# Altium schematic sheet USBC.SchDoc
size A; SheetNumber: 8; SheetTotal: 14
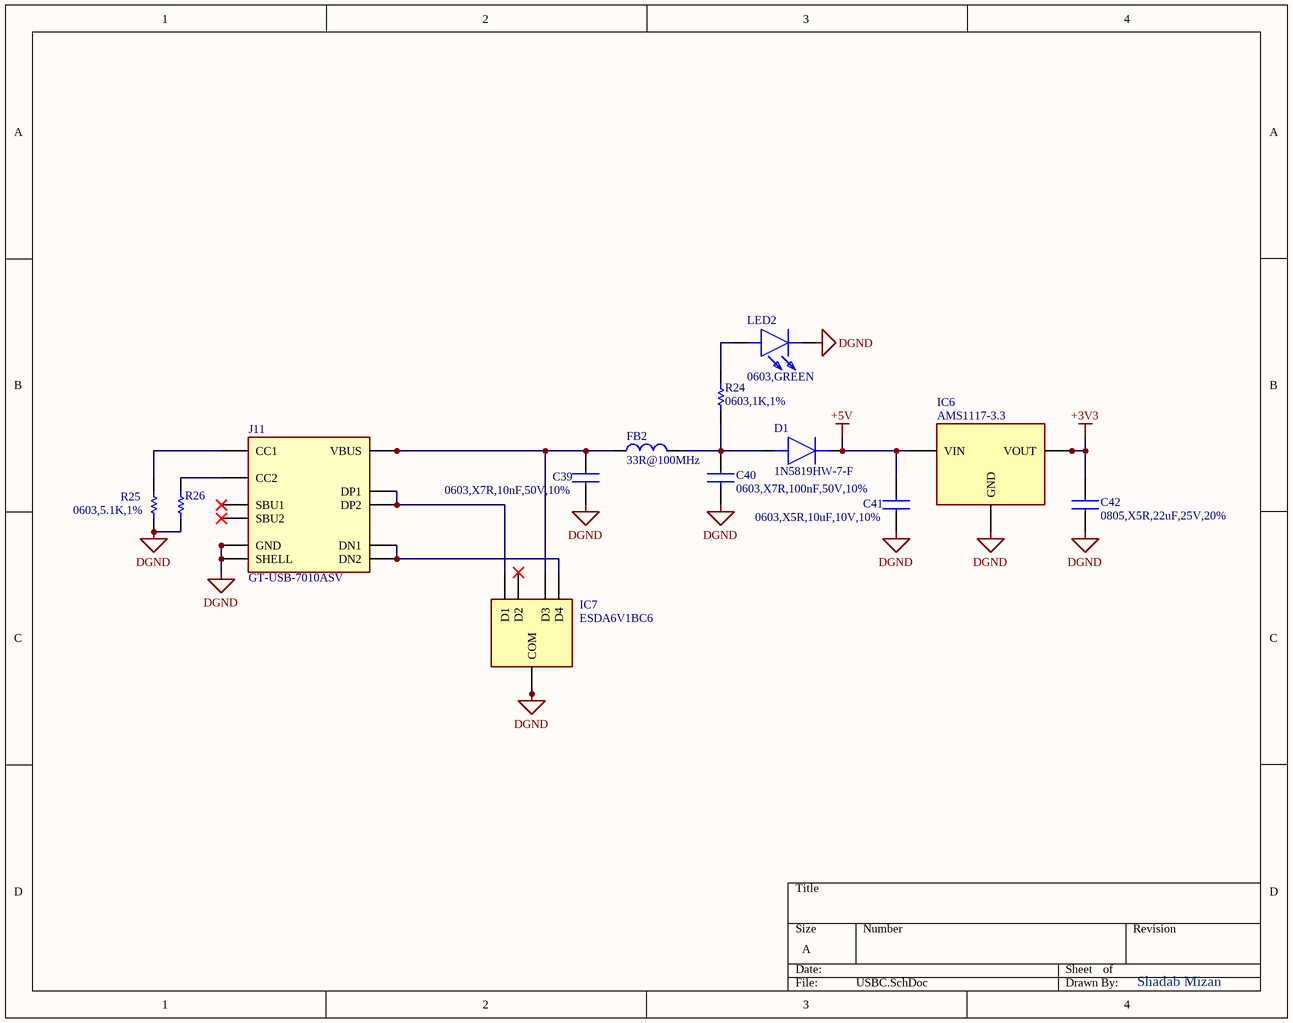
[diagram p0: USBC.SchDoc]

## Parts
C39  0603,X7R,10nF,50V,10%  [CAPC1608X90N]
C40  0603,X7R,100nF,50V,10%  [CAPC1608X90N]
C41  0603,X5R,10uF,10V,10%  [CAPC1608X90N]
C42  0805,X5R,22uF,25V,20%  [CAPC2012X145N]
D1  1N5819HW-7-F  [SOD3716X125N]
FB2  33R@100MHz  [BLM18SP221SN1B]
IC6  AMS1117-3.3  [SOT230P700X180-4N]
IC7  ESDA6V1BC6  [SOT95P280X145-6N]
J11  GT-USB-7010ASV  [USB-C-SMD_G-SWITCH_GT-USB-7010ASV]
LED2  0603,GREEN  [LEDC1608X36N]
R24  0603,1K,1%  [RESC1608X90N]
R25  0603,5.1K,1%  [RESC1608X55N]
R26  0603,5.1K,1%  [RESC1608X55N]  (value not drawn)

## Nets
+3V3: C42.2 IC6.2(OUTPUT) IC6.4(VOUT)
+5V: C41.2 D1.1(K) IC6.3(VIN)
DGND: C39.1 C40.1 C41.1 C42.1 IC6.1(GND) IC7.2(COM) IC7.5(COM) J11.1(SHELL) J11.2(SHELL) J11.3(SHELL) J11.4(SHELL) J11.A1B12(GND) J11.B1A12(GND) LED2.1(K) R25.2 R26.2
NetC39_2: C39.2 FB2.1 IC7.4(D3) J11.A4B9(VBUS) J11.B4A9(VBUS)
NetC40_2: C40.2 D1.2(A) FB2.2 R24.1
NetIC7_1: IC7.1(D1) J11.A6(DP1) J11.B6(DP2)
NetIC7_6: IC7.6(D4) J11.A7(DN1) J11.B7(DN2)
NetJ11_A5: J11.A5(CC1) R25.1
NetJ11_B5: J11.B5(CC2) R26.1
NetLED2_2: LED2.2(A) R24.2

Not connected (* = marked no-connect by the designer): IC7 3(D2)*; J11 A8(SBU1)* B8(SBU2)*

## Notes on the sheet
- Shadab Mizan

## Library data of the parts
C39 = 0603B103K500NT: 10nF ±10% 50V Ceramic Capacitor X7R 0603; LCSC Part #: C57112; Manu Part #: 0603B103K500NT
C40 = CC0603KRX7R9BB104: 50V 100nF X7R ±10% 0603 Multilayer Ceramic Capacitors MLCC - SMD/SMT ROHS; LCSC Part #: C14663; Manu Part #: CC0603KRX7R9BB104
C41 = CL10A106KP8NNNC: 10uF ±10% 10V Ceramic Capacitor X5R 0603; LCSC Part #: C19702; Manu Part #: CL10A106KP8NNNC
C42 = CL21A226MAQNNNE: 22uF ±20% 25V Ceramic Capacitor X5R 0805; LCSC Part #: C45783; Manu Part #: CL21A226MAQNNNE
D1 = 1N5819HW-7-F: 25A 1 Independent 40V 450mV@1A 1A SOD-123 Single Diodes RoHS; Manu Part #: 1N5819HW-7-F; LCSC Part #: C82544
FB2 = BLM18SG330SN1D: 33Ω@100MHz 1 Line Ferrite Bead 0603 6A 8mΩ; Manu Part #: BLM18SG330SN1D; LCSC Part #: C576399
IC6 = AMS1117-3.3: 70dB@(120Hz) 1.35A Fixed 3.3V Positive 10V SOT-223 Voltage Regulators - Linear, Low Drop Out (LDO) Regulators ROHS; LCSC Part #: C6186; Manu Part #: AMS1117-3.3
IC7 = ESDA6V1BC6: Clamp Ipp Tvs Diode Surface Mount SOT-23-6; LCSC Part #: C495220; Manu Part #: ESDA6V1BC6
J11 = GT-USB-7010ASV: USB 2.0 3A 1 Surface Mount, Right Angle 16P Female -40℃~+85℃ Type-C SMD USB Connectors ROHS; LCSC Part #: C2988369; Manu Part #: GT-USB-7010ASV
LED2 = SML-E12P8WT86: Green LED Indication - Discrete 2.2V 0603; Manu Part #: SML-E12P8WT86; LCSC Part #: C126319
R24 = 0603WAF1001T5E: 100mW 1kΩ 75V Thick Film Resistor ±100ppm/℃ ±1% 0603 Chip Resistor - Surface Mount RoHS; LCSC Part #: C21190; Manu Part #: 0603WAF1001T5E
R25 R26 = RC0603FR-075K1L: 100mW 5.1kΩ 75V Thick Film Resistor ±100ppm/℃ ±1% 0603 Chip Resistor - Surface Mount RoHS; LCSC Part #: C105580; Manu Part #: RC0603FR-075K1L